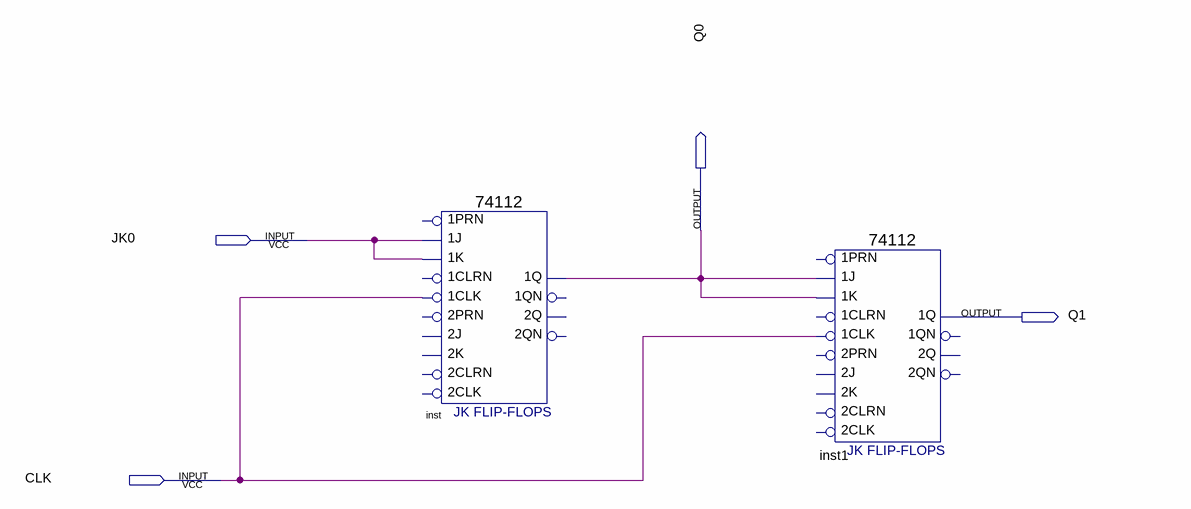
[diagram p0: schematic sheet]
// Quartus schematic Block1.bdf as structural Verilog: 2 symbols, 4 pins
module Block1 (
  input  JK0,
  input  CLK,
  output Q0,
  output Q1
);

  \74112  inst (
    .\1K (JK0), .\1J (JK0), .\1CLK (CLK), .\1Q (Q0));  // open: 1PRN, 1CLRN, 2K, 2J, 2PRN, 2CLK, 2CLRN, 1QN, 2Q, 2QN
  \74112  inst1 (
    .\1K (Q0), .\1J (Q0), .\1CLK (CLK), .\1Q (Q1));  // open: 1PRN, 1CLRN, 2K, 2J, 2PRN, 2CLK, 2CLRN, 1QN, 2Q, 2QN
endmodule
